# EAGLE schematic stm32 (EAGLE 6.4)
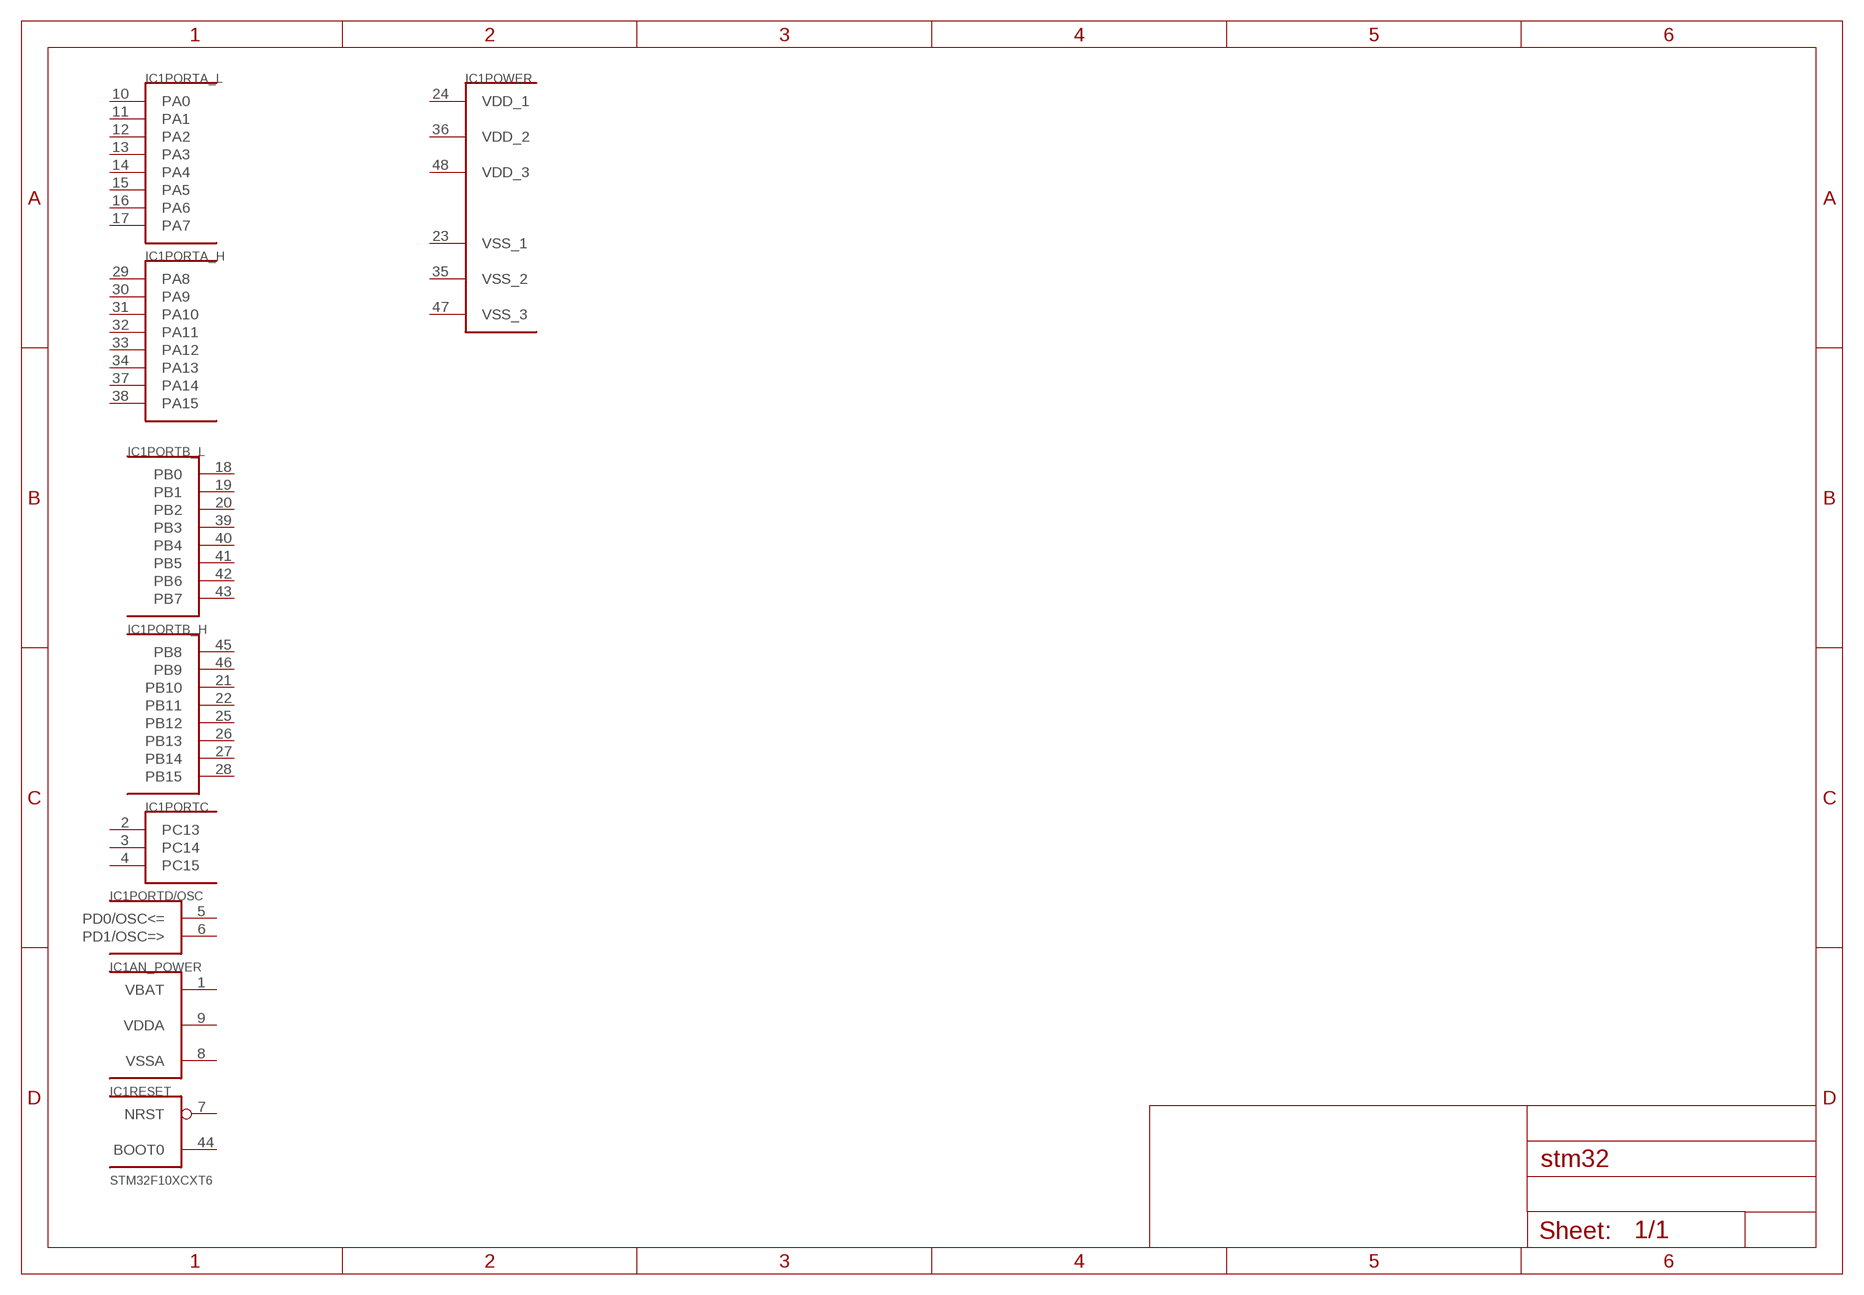
[diagram p0: schematic, sheet 1]

## Parts
IC1  STM32F10XCXT6  [TQFP48]
Unconnected: IC1.2(PORTC:PC13) IC1.3(PORTC:PC14) IC1.4(PORTC:PC15) IC1.5(PORTD/OSC:PD0/OSC<=) IC1.6(PORTD/OSC:PD1/OSC=>) IC1.7(RESET:NRST) IC1.10(PORTA_L:PA0) IC1.11(PORTA_L:PA1) IC1.12(PORTA_L:PA2) IC1.13(PORTA_L:PA3) IC1.14(PORTA_L:PA4) IC1.15(PORTA_L:PA5) IC1.16(PORTA_L:PA6) IC1.17(PORTA_L:PA7) IC1.18(PORTB_L:PB0) IC1.19(PORTB_L:PB1) IC1.20(PORTB_L:PB2) IC1.21(PORTB_H:PB10) IC1.22(PORTB_H:PB11) IC1.25(PORTB_H:PB12) IC1.26(PORTB_H:PB13) IC1.27(PORTB_H:PB14) IC1.28(PORTB_H:PB15) IC1.29(PORTA_H:PA8) IC1.30(PORTA_H:PA9) IC1.31(PORTA_H:PA10) IC1.32(PORTA_H:PA11) IC1.33(PORTA_H:PA12) IC1.34(PORTA_H:PA13) IC1.37(PORTA_H:PA14) IC1.38(PORTA_H:PA15) IC1.39(PORTB_L:PB3) IC1.40(PORTB_L:PB4) IC1.41(PORTB_L:PB5) IC1.42(PORTB_L:PB6) IC1.43(PORTB_L:PB7) IC1.44(RESET:BOOT0) IC1.45(PORTB_H:PB8) IC1.46(PORTB_H:PB9)

## Power pins joined to a net without a drawn wire
VBAT: IC1.1(AN_POWER:VBAT)
VDD_1: IC1.24(POWER:VDD_1)
VDD_2: IC1.36(POWER:VDD_2)
VDD_3: IC1.48(POWER:VDD_3)
VDDA: IC1.9(AN_POWER:VDDA)
VSS_1: IC1.23(POWER:VSS_1)
VSS_2: IC1.35(POWER:VSS_2)
VSS_3: IC1.47(POWER:VSS_3)
VSSA: IC1.8(AN_POWER:VSSA)

## Library data of the parts
IC1 = stm32:STM32F10XCXT6: ST STM32F101/103 48pin LQFP